# Altium project Tracker_v1_1.PrjPCB (part 2 of 2)
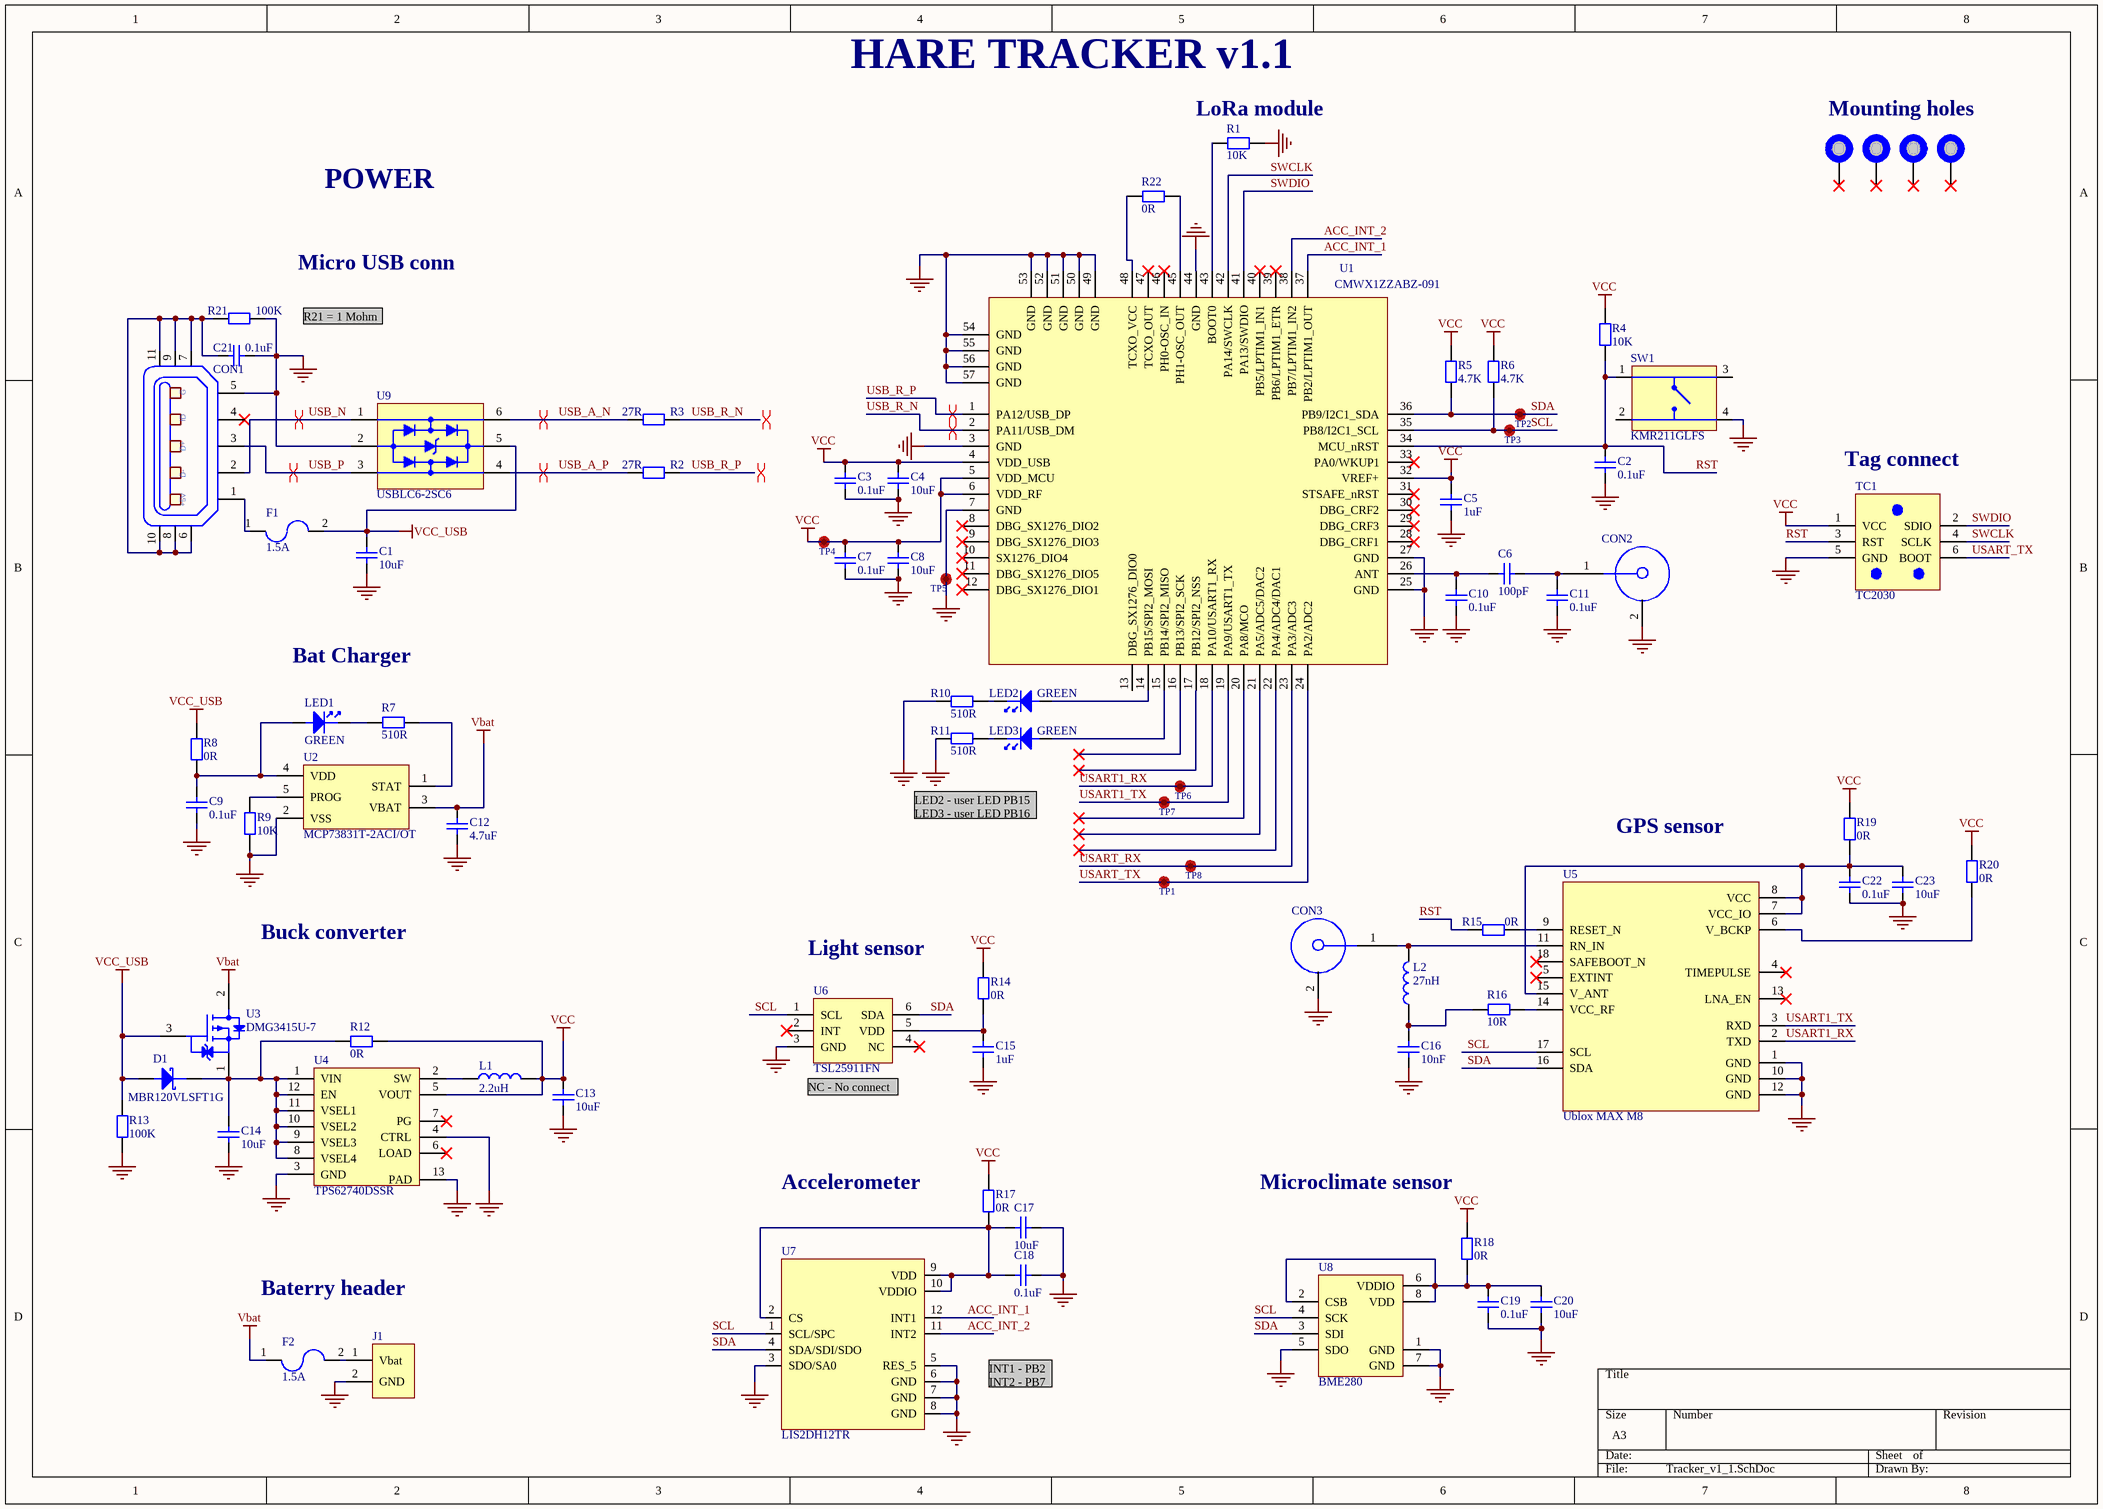
[diagram p1: Tracker_v1_1.SchDoc]

## Sheet Tracker_v1_1.SchDoc (continued)

### Library data of the parts
C1 C4 C8 C13 C14 C17 C20 C23 = C0603C106M8PACTU: CAP CER 10UF 10V X5R 0603; Manufacturer: KEMET; Supplier 1: Farnell; Manufacturer Part Number: C0603C106M8PACTU; Stock 1: 0; Pricing 1: 150=0.424, 500=0.311, 1000=0.26 (EUR); Supplier Part Number 1: 2820985RL
C2 C3 C7 C9-C11 C18 C19 C21 C22 = C0603C104J3RACTU: CAP CER 0.1UF 25V X7R 0603; Manufacturer: KEMET; Dielectric Material: Ceramic; Capacitance: 100nF; Tolerance: 5%; Supplier 1: Farnell; Manufacturer Part Number: C0603C104J3RACTU; Stock 1: 0; Pricing 1: 150=0.158, 500=0.132, 1000=0.12 (EUR); Mount: Surface Mount,PCB; Case/Package: 0603; Number of Pins: 2; Case Code (Metric): 1608; Case Code (Imperial): 0603; Contact Plating: Tin,Matte; Min Operating Temperature: -55°C; Max Operating Temperature: 125°C; Packaging: Tape and Reel; Dielectric: X7R; Package Quantity: 4000; Voltage Rating: 25V; Voltage Rating (DC): 25V; Termination: SMD/SMT; Voltage: 25V; Length: 1.6mm; Height: 0.8mm; Depth: 0.8mm; Width: 0.031inch; Thickness: 0.034inch; Lead Pitch: 0.7mm; Radiation Hardening: No; REACH SVHC: No SVHC; ComponentLink1URL: https://www.verical.com/server-webapp/html/getDatasheet?partID=33575&src-supplier=Verical; ComponentLink1Description: https://www.verical.com/server-webapp/html/getDatasheet?partID=33575&src-supplier=Verical; ComponentLink2URL: http://www.farnell.com/datasheets/1851736.pdf?src-supplier=Element14; ComponentLink2Description: http://www.farnell.com/datasheets/1851736.pdf?src-supplier=Element14; ComponentLink3URL: https://www.alliedelec.com/m/d/9bfe7773041ffe9d406e68bc7b377fdd.pdf?src-supplier=Allied+Electronics; ComponentLink3Description: https://www.alliedelec.com/m/d/9bfe7773041ffe9d406e68bc7b377fdd.pdf?src-supplier=Allied+Electronics; ComponentLink4URL: http://www.kemet.com/kemet/web/homepage/kechome.nsf/vapubfiles/KEM_C1002_X7R_SMD.pdf/$file/KEM_C1002_X7R_SMD.pdf?src-supplier=Element14; ComponentLink4Description: http://www.kemet.com/kemet/web/homepage/kechome.nsf/vapubfiles/KEM_C1002_X7R_SMD.pdf/$file/KEM_C1002_X7R_SMD.pdf?src-supplier=Element14; Supplier Part Number 1: 1650833RL
C5 C15 = C0603C105K8RACTU: Cap Ceramic 1uF 10V X7R 10% SMD 0603 125C T/R; Manufacturer: KEMET; Dissipation Factor: 5%; Supplier 1: Farnell; Manufacturer Part Number: C0603C105K8RACTU; Stock 1: 0; Pricing 1: 150=0.0567, 500=0.0425, 1000=0.0372 (EUR); Mount: Surface Mount; Case/Package: 0603; Case Code (Imperial): 0603; Case Code (Metric): 1608; Contact Plating: Tin,Matte; Dielectric Material: Ceramic; Min Operating Temperature: -55°C; Max Operating Temperature: 125°C; Packaging: Tape and Reel; Capacitance: 1uF; Package Quantity: 1; Voltage Rating: 10V; Voltage Rating (DC): 10V; Tolerance: 10%; Dielectric: X7R; Termination: SMD/SMT; Length: 1.6mm; Height: 0.8mm; Width: 0.8mm; Thickness: 0.035inch; Depth: 0.8mm; Radiation Hardening: No; REACH SVHC: No SVHC; ComponentLink1URL: https://www.verical.com/server-webapp/html/getDatasheet?partID=212378&src-supplier=Verical; ComponentLink1Description: https://www.verical.com/server-webapp/html/getDatasheet?partID=212378&src-supplier=Verical; Supplier Part Number 1: 2522396RL
C6 = C0603C101K5GACTU: Cap Ceramic 100pF 50V C0G 10% SMD 0603 125C Paper T/R; Manufacturer: KEMET; Dissipation Factor: 0.1%; Supplier 1: Farnell; Manufacturer Part Number: C0603C101K5GACTU; Stock 1: 0; Mount: Surface Mount,PCB; Case/Package: 0603; Dielectric Material: Ceramic; Case Code (Metric): 1608; Case Code (Imperial): 0603; Contact Plating: Tin,Matte; Min Operating Temperature: -55°C; Max Operating Temperature: 125°C; Capacitance: 100pF; Tolerance: 10%; Packaging: Tape and Reel; Voltage Rating (DC): 50V; Dielectric: C0G; Package Quantity: 1; Voltage Rating: 50V; Termination: SMD/SMT; Length: 1.6mm; Height: 0.8mm; Width: 0.031inch; Thickness: 0.034inch; Lead Pitch: 0.7mm; Depth: 0.8mm; Radiation Hardening: No; REACH SVHC: No SVHC; Lead Free: Lead Free; ComponentLink1URL: http://www.onlinecomponents.com/productFiles/mf-KEM/kem_c1003_c0g_smd.pdf?src-supplier=Onlinecomponents.com; ComponentLink1Description: http://www.onlinecomponents.com/productFiles/mf-KEM/kem_c1003_c0g_smd.pdf?src-supplier=Onlinecomponents.com; ComponentLink2URL: https://www.verical.com/server-webapp/html/getDatasheet?partID=77366&src-supplier=Verical; ComponentLink2Description: https://www.verical.com/server-webapp/html/getDatasheet?partID=77366&src-supplier=Verical; ComponentLink3URL: http://www.farnell.com/datasheets/1828801.pdf?src-supplier=Element14; ComponentLink3Description: http://www.farnell.com/datasheets/1828801.pdf?src-supplier=Element14; ComponentLink4URL: http://www.mouser.com/ds/2/212/KEM_C1003_C0G_SMD-1101588.pdf?src-supplier=Mouser; ComponentLink4Description: http://www.mouser.com/ds/2/212/KEM_C1003_C0G_SMD-1101588.pdf?src-supplier=Mouser; Supplier Part Number 1: 1823375
C12 = C0603C475K9PACTU: CAP CER 4.7UF 6.3V X5R 0603; Manufacturer: KEMET; Dielectric Material: Ceramic; Tolerance: 10%; Dissipation Factor: 5%; Supplier 1: Farnell; Manufacturer Part Number: C0603C475K9PACTU; Stock 1: 0; Mount: Surface Mount,PCB; Case/Package: 0603; Number of Pins: 2; Case Code (Metric): 1608; Case Code (Imperial): 0603; Contact Plating: Tin,Matte; Min Operating Temperature: -55°C; Max Operating Temperature: 85°C; Package Quantity: 1; Capacitance: 4.7uF; Voltage Rating: 6.3V; Packaging: Tape and Reel; Voltage Rating (DC): 6.3V; Dielectric: X5R; Termination: SMD/SMT; Voltage: 6.3V; Length: 1.6mm; Height: 0.8mm; Width: 0.031inch; Thickness: 0.035inch; Lead Pitch: 0.7mm; Depth: 0.8mm; Radiation Hardening: No; REACH SVHC: No SVHC; Lead Free: Lead Free; ComponentLink1URL: https://api.kemet.com/component-edge/download/datasheet/C0603C475K9PACTU.pdf?src-supplier=Digi-Key; ComponentLink1Description: https://api.kemet.com/component-edge/download/datasheet/C0603C475K9PACTU.pdf?src-supplier=Digi-Key; ComponentLink2URL: http://www.farnell.com/datasheets/1732700.pdf?src-supplier=Element14; ComponentLink2Description: http://www.farnell.com/datasheets/1732700.pdf?src-supplier=Element14; ComponentLink3URL: http://www.farnell.com/datasheets/1789732.pdf?src-supplier=Element14; ComponentLink3Description: http://www.farnell.com/datasheets/1789732.pdf?src-supplier=Element14; ComponentLink4URL: http://www.farnell.com/datasheets/40889.pdf?src-supplier=Element14; ComponentLink4Description: http://www.farnell.com/datasheets/40889.pdf?src-supplier=Element14; Supplier Part Number 1: 1310155
C16 = C0603C103J3GACTU: 0603 C 10nF Ceramic Multilayer Capacitor, 25 V, +125degC, C0G Dielectric, +/-5%; Manufacturer: KEMET; Tolerance: 5%; Voltage Rating (DC): 25V; Voltage: 50V; Temperature Coefficient: 30ppm/°C; Dissipation Factor: 0.1%; Supplier 1: Digi-Key; Manufacturer Part Number: C0603C103J3GACTU; Stock 1: 0; Mount: Surface Mount; Case/Package: 0603; Number of Pins: 2; Dielectric Material: Ceramic; Case Code (Metric): 1608; Case Code (Imperial): 0603; Contact Plating: Tin,Matte; Min Operating Temperature: -55°C; Max Operating Temperature: 125°C; Capacitance: 10nF; Packaging: Tape and Reel; Dielectric: C0G; Voltage Rating: 25V; Package Quantity: 4000; Termination: SMD/SMT; Length: 1.6mm; Height: 0.8mm; Depth: 0.8mm; Width: 0.8mm; Thickness: 0.034inch; Radiation Hardening: No; Lead Free: Lead Free; REACH SVHC: No SVHC; ComponentLink1URL: https://www.verical.com/server-webapp/html/getDatasheet?partID=556319&src-supplier=Verical; ComponentLink1Description: https://www.verical.com/server-webapp/html/getDatasheet?partID=556319&src-supplier=Verical; ComponentLink2URL: http://www.farnell.com/datasheets/2315092.pdf?src-supplier=Farnell; ComponentLink2Description: http://www.farnell.com/datasheets/2315092.pdf?src-supplier=Farnell; ComponentLink3URL: http://www.farnell.com/datasheets/1732695.pdf?src-supplier=Element14; ComponentLink3Description: http://www.farnell.com/datasheets/1732695.pdf?src-supplier=Element14; ComponentLink4URL: http://www.mouser.com/ds/2/212/KEM_C1003_C0G_SMD-1101588.pdf?src-supplier=Mouser; ComponentLink4Description: http://www.mouser.com/ds/2/212/KEM_C1003_C0G_SMD-1101588.pdf?src-supplier=Mouser; Supplier Part Number 1: C0603C103J3GACTU-ND
CON1 = Micro USB SMD: AMPHENOL FCI - 10104110-0001LF - MICRO USB, 2.0 TYPE B, RECEPTACLE, SMT; USB Connector Type: Micro USB Type B; USB Standard: USB 2.0; No. of Positions: 5; Connector Mounting: Surface Mount; SVHC: No SVHC (15-Jun-2015); Connector Type: USB Micro B; Contact Termination: Surface Mount Right Angle; No. of Contacts: 5Contacts<!--FANDB--><div class="features-and-benefits-container"><div class="features-and-benefits-description"><span class="features-benefits-value">The 10104110-0001LF is a micro-USB type-B Receptacle Connector, comply with physical, electrical and environmental requirements of micro-USB standard (USB 2.0). Space receptacles and plugs are available in a wide variety of mounting and termination configurations, permitting their use in various applications. Compared with the standard mini-B connectors, the size is reduced by approximately 60% while still allowing a high-speed data transfer of 480; Supplier 1: Farnell; Manufacturer: AMPHENOL FCI; Manufacturer Part Number: 10104110-0001LF; RoHS: YES; Stock 1: 25585; Pricing 1: 1=0.464, 10=0.451, 25=0.437, 50=0.424, 100=0.41, 250=0.291 (GBP); Gender: Receptacle; Orientation: Right Angle; Contact Material: Copper Alloy; Contact Plating: Gold Plated Contacts; Product Range: -; Contact Termination Type: Surface Mount; ComponentLink1URL: http://www.farnell.com/datasheets/1469072.pdf; ComponentLink1Description: http://www.farnell.com/datasheets/1469072.pdf; Supplier Part Number 1: 2293753
CON2 CON3 = 73412-0110: RF Connectors / Coaxial Connectors MCX V PCB JACK SMT 1.25MM MNT HGT; Manufacturer: Molex; Body Material: Liquid Crystal Polymer,Polymer; Body Plating: Gold; Impedance: 50R; Frequency: 6GHz; Voltage Rating: 60V; Gender: Female; Mating Cycles: 30; Insulation Resistance: 500MR; Polarity: Standard; Supplier 1: Farnell; Manufacturer Part Number: 73412-0110; Stock 1: 4654; Pricing 1: 1=0.402, 150=0.368, 400=0.334, 1250=0.327, 2500=0.32 (EUR); Mount: PCB,Surface Mount,Through Hole; Contact Material: Brass,Bronze; Contact Plating: Gold; Material: Bronze; Min Operating Temperature: -40°C; Max Operating Temperature: 90°C; Termination: Solder; Connector Type: Coaxial; Package Quantity: 5000; Packaging: Tape and Reel; Max Frequency: 6GHz; Orientation: Straight; Voltage Rating (AC): 60V; Radiation Hardening: No; REACH SVHC: Unknown; Halogen Free: Low Halogen; Lead Free: Lead Free; ComponentLink1URL: http://www.molex.com/webdocs/datasheets/pdf/en-us/0734120110_RF_COAX_CONNECTORS.pdf?src-supplier=Avnet+Europe; ComponentLink1Description: http://www.molex.com/webdocs/datasheets/pdf/en-us/0734120110_RF_COAX_CONNECTORS.pdf?src-supplier=Avnet+Europe; ComponentLink2URL: http://uk.rs-online.com/webdocs/13c4/0900766b813c49d5.pdf?src-supplier=RSComponents; ComponentLink2Description: http://uk.rs-online.com/webdocs/13c4/0900766b813c49d5.pdf?src-supplier=RSComponents; ComponentLink3URL: http://www.farnell.com/datasheets/1841262.pdf?src-supplier=Farnell; ComponentLink3Description: http://www.farnell.com/datasheets/1841262.pdf?src-supplier=Farnell; ComponentLink4URL: http://www.molex.com/webdocs/datasheets/pdf/en-us/0734120110_RF_COAX_CONNECTORS.pdf?src-supplier=Mouser; ComponentLink4Description: http://www.molex.com/webdocs/datasheets/pdf/en-us/0734120110_RF_COAX_CONNECTORS.pdf?src-supplier=Mouser; ComponentLink5URL: http://www.onlinecomponents.com/productFiles/mf-MOL/1387750734120110_rf_coax_nectors.pdf?src-supplier=Onlinecomponents.com; ComponentLink5Description: http://www.onlinecomponents.com/productFiles/mf-MOL/1387750734120110_rf_coax_nectors.pdf?src-supplier=Onlinecomponents.com; ComponentLink6URL: http://www.farnell.com/datasheets/1808577.pdf?src-supplier=Element14; ComponentLink6Description: http://www.farnell.com/datasheets/1808577.pdf?src-supplier=Element14; ComponentLink7URL: http://www.molex.com/webdocs/datasheets/pdf/en-us/0734120110_RF_COAX_CONNECTORS.pdf?src-supplier=Avnet; ComponentLink7Description: http://www.molex.com/webdocs/datasheets/pdf/en-us/0734120110_RF_COAX_CONNECTORS.pdf?src-supplier=Avnet; Supplier Part Number 1: 1340200
D1 = MBR120VLSFT1G: DIODE SCHOTTKY 20V 1A SOD123FL; Manufacturer: ON Semiconductor; Max Surge Current: 45A; Forward Voltage: 340mV; Peak Reverse Current: 600uA; Element Configuration: Single; Polarity: Standard; Supplier 1: Farnell; Manufacturer Part Number: MBR120VLSFT1G; Stock 1: 0; Number of Pins: 2; Contact Plating: Tin,Matte; Min Operating Temperature: -65°C; Max Operating Temperature: 125°C; Package Quantity: 3000; Forward Current: 1A; Packaging: Tape and Reel; Max Reverse Leakage Current: 600uA; Average Rectified Current: 1A; Max Repetitive Reverse Voltage (Vrrm): 20V; Max Forward Surge Current (Ifsm): 45A; Peak Non-Repetitive Surge Current: 45A; Voltage Rating (DC): 20V; Current Rating: 1A; Output Current: 1A; Max Reverse Voltage (DC): 20V; Length: 2.9mm; Height: 0.9mm; Width: 1.8mm; Radiation Hardening: No; REACH SVHC: No SVHC; Lead Free: Lead Free; Halogen Free: Halogen Free; ComponentLink1URL: http://www.farnell.com/datasheets/85900.pdf?src-supplier=Element14; ComponentLink1Description: http://www.farnell.com/datasheets/85900.pdf?src-supplier=Element14; ComponentLink2URL: http://www.onsemi.cn/pub_link/Collateral/MBR120VLSFT1-D.PDF?src-supplier=Avnet+Europe; ComponentLink2Description: http://www.onsemi.cn/pub_link/Collateral/MBR120VLSFT1-D.PDF?src-supplier=Avnet+Europe; ComponentLink3URL: https://www.alliedelec.com/m/d/71572cff3445748bb7aa75769c4030bb.pdf?src-supplier=Allied+Electronics; ComponentLink3Description: https://www.alliedelec.com/m/d/71572cff3445748bb7aa75769c4030bb.pdf?src-supplier=Allied+Electronics; ComponentLink4URL: http://www.onsemi.com/pub/Collateral/MBR120VLSFT1-D.PDF?src-supplier=Future+Electronics; ComponentLink4Description: http://www.onsemi.com/pub/Collateral/MBR120VLSFT1-D.PDF?src-supplier=Future+Electronics; ComponentLink5URL: http://www.onsemi.com/pub/Collateral/MBR120VLSFT1-D.PDF?src-supplier=Digi-Key; ComponentLink5Description: http://www.onsemi.com/pub/Collateral/MBR120VLSFT1-D.PDF?src-supplier=Digi-Key; ComponentLink6URL: http://www.onsemi.cn/pub_link/Collateral/MBR120VLSFT1-D.PDF?src-supplier=Avnet+Asia; ComponentLink6Description: http://www.onsemi.cn/pub_link/Collateral/MBR120VLSFT1-D.PDF?src-supplier=Avnet+Asia; Supplier Part Number 1: 2393584
F1 F2 = 046701.5NR: FUSE BOARD MNT 1.5A 32VAC 65VDC; Manufacturer: Littelfuse; Body Material: Thermoplastic; Voltage Rating (AC): 32V; DC Cold Resistance: 38.5mR; Power Dissipation: 121.7mW; Fuse Type: Board Mount (Cartridge Style Excluded); Resistance: 41mR; Approvals: UL,CSA; Supplier 1: Farnell; Manufacturer Part Number: 046701.5NR; Stock 1: 0; Mount: Surface Mount; Case/Package: 0603; Number of Pins: 2; Case Code (Metric): 1608; Case Code (Imperial): 0603; Min Operating Temperature: -55°C; Max Operating Temperature: 90°C; Voltage Rating (DC): 32V; Current Rating: 1.5A; Packaging: Tape and Reel; Package Quantity: 5000; Composition: Thin Film; Voltage Rating: 32V; Termination: SMD/SMT; Fuse Current: 1.5A; Working Voltage: 32V; Length: 1.6mm; Height: 0.012inch; Width: 0.813mm; Depth: 0.81mm; Radiation Hardening: No; REACH SVHC: Unknown; Lead Free: Lead Free; ComponentLink1URL: http://www.farnell.com/datasheets/1851810.pdf?src-supplier=Element14; ComponentLink1Description: http://www.farnell.com/datasheets/1851810.pdf?src-supplier=Element14; ComponentLink2URL: http://www.littelfuse.com/~/media/electronics/datasheets/fuses/littelfuse_fuse_467_datasheet.pdf.pdf?src-supplier=Digi-Key; ComponentLink2Description: http://www.littelfuse.com/~/media/electronics/datasheets/fuses/littelfuse_fuse_467_datasheet.pdf.pdf?src-supplier=Digi-Key; ComponentLink3URL: http://www.littelfuse.com/data/en/Data_Sheets/467.pdf?src-supplier=Future+Electronics; ComponentLink3Description: http://www.littelfuse.com/data/en/Data_Sheets/467.pdf?src-supplier=Future+Electronics; ComponentLink4URL: https://www.verical.com/server-webapp/html/getDatasheet?partID=772543&src-supplier=Verical; ComponentLink4Description: https://www.verical.com/server-webapp/html/getDatasheet?partID=772543&src-supplier=Verical; Supplier Part Number 1: 1596948RL
J1 = Header 2x1
L1 = L1210R2R2MDWIT: FIXED IND 2.2UH 2A 80 MOHM SMD; Manufacturer: KEMET; Core Material: Ferrite; Tolerance: 20%; Shielding: Unshielded; Self Resonant Frequency: 190MHz; DC Resistance (DCR): 80mR; Test Frequency: 100kHz; DC Current: 1.13A; Supplier 1: Digi-Key; Manufacturer Part Number: L1210R2R2MDWIT; Stock 1: 17546; Pricing 1: 1=0.55, 10=0.479, 100=0.3421, 500=0.2874 (USD); Mount: Surface Mount; Case/Package: 1210; Case Code (Metric): 3225; Case Code (Imperial): 1210; Min Operating Temperature: -40°C; Max Operating Temperature: 105°C; Package Quantity: 1000; Current Rating: 2A; Packaging: Tape and Reel; Inductance Tolerance: 20%; Composition: Ceramic,Wirewound; Inductance: 2.2uH; Max DC Current: 2A; Termination: SMD/SMT; Military Standard: Not; Length: 0.126inch; Height: 2.5mm; Width: 0.098inch; Height - Seated (Max): 0.106inch; Depth: 2.7mm; Radiation Hardening: No; REACH SVHC: No SVHC; ComponentLink1URL: https://content.kemet.com/datasheets/F3115.pdf?src-supplier=Mouser; ComponentLink1Description: https://content.kemet.com/datasheets/F3115.pdf?src-supplier=Mouser; ComponentLink2URL: https://content.kemet.com/datasheets/F3115.pdf?src-supplier=Avnet+Europe; ComponentLink2Description: https://content.kemet.com/datasheets/F3115.pdf?src-supplier=Avnet+Europe; ComponentLink3URL: http://www.farnell.com/datasheets/27262.pdf?src-supplier=Element14; ComponentLink3Description: http://www.farnell.com/datasheets/27262.pdf?src-supplier=Element14; ComponentLink4URL: https://api.kemet.com/component-edge/download/datasheet/L1210R2R2MDWIT.pdf?src-supplier=Digi-Key; ComponentLink4Description: https://api.kemet.com/component-edge/download/datasheet/L1210R2R2MDWIT.pdf?src-supplier=Digi-Key; ComponentLink5URL: http://www.kemet.com/Lists/ProductCatalog/Attachments/57/F3115.pdf?src-supplier=Avnet; ComponentLink5Description: http://www.kemet.com/Lists/ProductCatalog/Attachments/57/F3115.pdf?src-supplier=Avnet; Supplier Part Number 1: 399-9598-6-ND
L2 = LQG18HN27NJ00D: Inductor RF Chip Multi-Layer 27nH 5% 100MHz 12Q-Factor Air 300mA 550mOhm DCR 0603 T/R; Manufacturer: Murata; DC Resistance (DCR): 550mR; Q Factor: 12; Self Resonant Frequency: 2GHz; Shielding: Unshielded; Supplier 1: Digi-Key; Manufacturer Part Number: LQG18HN27NJ00D; Stock 1: 0; Mount: Surface Mount; Case/Package: 0603; Core Material: Air; Case Code (Metric): 1608; Case Code (Imperial): 0603; Min Operating Temperature: -55°C; Max Operating Temperature: 85°C; Tolerance: 5%; Inductance: 27nH; Packaging: Tape and Reel; Current Rating: 300mA; Max DC Current: 300mA; Inductance Tolerance: 5%; Package Quantity: 4000; Termination: SMD/SMT; Test Frequency: 100MHz; DC Current: 300mA; Military Standard: Not; Length: 0.063inch; Height: 0.8mm; Width: 0.8mm; Height - Seated (Max): 0.037inch; Depth: 0.95mm; Radiation Hardening: No; REACH SVHC: No SVHC; Lead Free: Lead Free; ComponentLink1URL: http://search.murata.co.jp/Ceramy/image/img/P02/JELF243B-0002.pdf?src-supplier=Digi-Key; ComponentLink1Description: http://search.murata.co.jp/Ceramy/image/img/P02/JELF243B-0002.pdf?src-supplier=Digi-Key; ComponentLink2URL: http://www.farnell.com/datasheets/5102.pdf?src-supplier=Element14; ComponentLink2Description: http://www.farnell.com/datasheets/5102.pdf?src-supplier=Element14; ComponentLink3URL: http://psearch.en.murata.com/inductor/product/LQG18HN27NJ00_.pdf?src-supplier=Digi-Key; ComponentLink3Description: http://psearch.en.murata.com/inductor/product/LQG18HN27NJ00_.pdf?src-supplier=Digi-Key; ComponentLink4URL: http://search.murata.co.jp/Ceramy/image/img/PDF/ENG/L0075S0083LQG18H.pdf?src-supplier=Avnet; ComponentLink4Description: http://search.murata.co.jp/Ceramy/image/img/PDF/ENG/L0075S0083LQG18H.pdf?src-supplier=Avnet; ComponentLink5URL: http://search.murata.co.jp/Ceramy/image/img/PDF/ENG/L0075S0083LQG18H.pdf?src-supplier=Avnet+Europe; ComponentLink5Description: http://search.murata.co.jp/Ceramy/image/img/PDF/ENG/L0075S0083LQG18H.pdf?src-supplier=Avnet+Europe; ComponentLink6URL: http://uk.rs-online.com/webdocs/0f10/0900766b80f1087c.pdf?src-supplier=RSComponents; ComponentLink6Description: http://uk.rs-online.com/webdocs/0f10/0900766b80f1087c.pdf?src-supplier=RSComponents; Supplier Part Number 1: 490-6579-2-ND
LED1-LED3 = KP-1608CGCK: KINGBRIGHT - KP-1608CGCK - LED, 0603, 50MCD, GREEN; Lens Color: Clear; Viewing Angle: 120°; Lens Style: Rectangular,Diffused,Colorless; Dominant Wavelength: 570nm; Number of LEDs: 1; Forward Voltage: 2.1V; Forward Current: 20mA; Supplier 1: Farnell; Manufacturer: Kingbright; Manufacturer Part Number: KP-1608CGCK; Stock 1: 18535; Pricing 1: 5=0.157, 50=0.143, 100=0.0934, 500=0.0789, 1000=0.0621 (EUR); Mount: Surface Mount; Case/Package: 1608; Number of Pins: 2; Color: Green; Luminous Intensity: 50mcd; Wavelength: 570nm; Packaging: Tape and Reel; Length: 0.8mm; Height: 1.1mm; Width: 1.6mm; Radiation Hardening: No; REACH SVHC: No SVHC; ComponentLink1URL: http://www.farnell.com/datasheets/2045956.pdf?src-supplier=Element14; ComponentLink1Description: http://www.farnell.com/datasheets/2045956.pdf?src-supplier=Element14; ComponentLink2URL: http://www.rapidonline.com/pdf/72-8670.pdf?src-supplier=Rapid+Electronics; ComponentLink2Description: http://www.rapidonline.com/pdf/72-8670.pdf?src-supplier=Rapid+Electronics; Supplier Part Number 1: 2290328
MH1-MH4 = MH_7.4MM_NC
R1 R4 R9 = CR0603-JW-103EAS: RES 10K OHM 5% 0.01W 0603; Manufacturer: Bourns; Supplier 1: Farnell; Manufacturer Part Number: CR0603-JW-103EAS; Stock 1: 0; Pricing 1: 150=0.0181, 500=0.0155, 1000=0.007 (EUR); Supplier Part Number 1: 2752989RL
R2 R3 = CRCW060327R0FKEA: RES SMD 27 OHM 1% 1/10W 0603; Manufacturer: Vishay; Power Rating: 100mW; Temperature Coefficient: 100ppm/°C; Voltage Rating: 75V; Supplier 1: Farnell; Manufacturer Part Number: CRCW060327R0FKEA; Stock 1: 0; Mount: Surface Mount; Case/Package: 0603; Number of Pins: 2; Weight: 7.1E-05oz; Contact Plating: Tin; Case Code (Imperial): 0603; Case Code (Metric): 1608; Min Operating Temperature: -55°C; Max Operating Temperature: 155°C; Resistance: 27R; Tolerance: 1%; Composition: Thick Film; Packaging: Tape and Reel; Termination: SMD/SMT; Package Quantity: 5000; Military Standard: Not; Voltage Rating (DC): 75V; Length: 1.55mm; Height: 0.45mm; Width: 0.85mm; Depth: 0.85mm; Radiation Hardening: No; REACH SVHC: Unknown; Lead Free: Lead Free; ComponentLink1URL: http://www.mouser.com/ds/2/427/dcrcwe3-109170.pdf?src-supplier=Mouser; ComponentLink1Description: http://www.mouser.com/ds/2/427/dcrcwe3-109170.pdf?src-supplier=Mouser; ComponentLink2URL: http://www.farnell.com/datasheets/2046716.pdf?src-supplier=Element14; ComponentLink2Description: http://www.farnell.com/datasheets/2046716.pdf?src-supplier=Element14; ComponentLink3URL: http://www.farnell.com/datasheets/1697337.pdf?src-supplier=Element14; ComponentLink3Description: http://www.farnell.com/datasheets/1697337.pdf?src-supplier=Element14; ComponentLink4URL: http://www.farnell.com/datasheets/2111203.pdf?src-supplier=Element14; ComponentLink4Description: http://www.farnell.com/datasheets/2111203.pdf?src-supplier=Element14; ComponentLink5URL: http://uk.rs-online.com/webdocs/0d98/0900766b80d98afc.pdf?src-supplier=RSComponents; ComponentLink5Description: http://uk.rs-online.com/webdocs/0d98/0900766b80d98afc.pdf?src-supplier=RSComponents; ComponentLink6URL: http://www.vishay.com/docs/20035/dcrcwe3.pdf?src-supplier=Avnet+Europe; ComponentLink6Description: http://www.vishay.com/docs/20035/dcrcwe3.pdf?src-supplier=Avnet+Europe; ComponentLink7URL: http://www.alliedelec.com/m/d/0c934d6939ccefa68dbe0b96d821c8cf.pdf?src-supplier=Allied+Electronics; ComponentLink7Description: http://www.alliedelec.com/m/d/0c934d6939ccefa68dbe0b96d821c8cf.pdf?src-supplier=Allied+Electronics; ComponentLink8URL: http://www.vishay.com/docs/20035/dcrcwe3.pdf?src-supplier=Future+Electronics; ComponentLink8Description: http://www.vishay.com/docs/20035/dcrcwe3.pdf?src-supplier=Future+Electronics; Supplier Part Number 1: 1151876
R5 R6 = CR0603-JW-472ELF: Res Thick Film 0603 4.7K Ohm 5% 1/10W ±200ppm/°C Molded SMD SMD Paper Tape on Plastic Reel; Manufacturer: Bourns; Resistance: 4.7kR; Power Rating: 100mW; Voltage Rating: 50V; Supplier 1: Farnell; Manufacturer Part Number: CR0603-JW-472ELF; Stock 1: 0; Mount: Surface Mount; Case/Package: 0603; Number of Pins: 2; Case Code (Metric): 1608; Case Code (Imperial): 0603; Contact Plating: Tin,Lead; Min Operating Temperature: -55°C; Max Operating Temperature: 155°C; Package Quantity: 1; Tolerance: 5%; Packaging: Tape and Reel; Composition: Thick Film; Number of Terminations: 2; Termination: SMD/SMT; Temperature Coefficient: 200ppm/°C; Max Power Dissipation: 100mW; Voltage Rating (DC): 50V; Features: Moisture Resistant; Length: 1.6mm; Height: 0.45mm; Width: 0.8mm; Depth: 0.8mm; Thickness: 457um; Radiation Hardening: No; REACH SVHC: No SVHC; ComponentLink1URL: http://www.farnell.com/datasheets/2178762.pdf?src-supplier=Newark; ComponentLink1Description: http://www.farnell.com/datasheets/2178762.pdf?src-supplier=Newark; ComponentLink2URL: http://www.bourns.com/pdfs/chpreztr.pdf?src-supplier=Avnet; ComponentLink2Description: http://www.bourns.com/pdfs/chpreztr.pdf?src-supplier=Avnet; ComponentLink3URL: https://www.alliedelec.com/m/d/8318635a9e5af6f7dacb272be3e73d2e.pdf?src-supplier=Allied+Electronics; ComponentLink3Description: https://www.alliedelec.com/m/d/8318635a9e5af6f7dacb272be3e73d2e.pdf?src-supplier=Allied+Electronics; ComponentLink4URL: http://www.farnell.com/datasheets/1856384.pdf?src-supplier=Element14; ComponentLink4Description: http://www.farnell.com/datasheets/1856384.pdf?src-supplier=Element14; ComponentLink5URL: http://uk.rs-online.com/webdocs/0fcd/0900766b80fcdb72.pdf?src-supplier=RSComponents; ComponentLink5Description: http://uk.rs-online.com/webdocs/0fcd/0900766b80fcdb72.pdf?src-supplier=RSComponents; ComponentLink6URL: http://www.produktinfo.conrad.com/datenblaetter/1000000-1099999/001055503-da-01-en-SMD_WID_CR0603_JW_472ELF_4_7K_OHM_1_10W.pdf?src-supplier=Conrad; ComponentLink6Description: http://www.produktinfo.conrad.com/datenblaetter/1000000-1099999/001055503-da-01-en-SMD_WID_CR0603_JW_472ELF_4_7K_OHM_1_10W.pdf?src-supplier=Conrad; Supplier Part Number 1: 2371774
R7 R10 R11 = CR0603-JW-511ELF: Res Thick Film 0603 510 Ohm 5% 1/10W ±200ppm/°C Molded SMD SMD Paper Tape on Plastic Reel; Manufacturer: Bourns; Power Rating: 100mW; Voltage Rating: 50V; Supplier 1: Farnell; Manufacturer Part Number: CR0603-JW-511ELF; Stock 1: 79590; Pricing 1: 10=0.016, 100=0.0113, 500=0.0089, 1000=0.0077 (EUR); Mount: Surface Mount; Case/Package: 0603; Case Code (Imperial): 0603; Case Code (Metric): 1608; Contact Plating: Tin; Min Operating Temperature: -55°C; Max Operating Temperature: 155°C; Resistance: 510R; Tolerance: 5%; Packaging: Tape and Reel; Package Quantity: 1; Composition: Thick Film; Termination: SMD/SMT; Number of Terminations: 2; Temperature Coefficient: 200ppm/°C; Military Standard: Not; Max Power Dissipation: 100mW; Features: Moisture Resistant; Length: 1.6mm; Height: 0.022inch; Width: 0.8mm; Depth: 0.8mm; Thickness: 457um; Radiation Hardening: No; ComponentLink1URL: http://www.bourns.com/pdfs/chpreztr.pdf?src-supplier=Avnet; ComponentLink1Description: http://www.bourns.com/pdfs/chpreztr.pdf?src-supplier=Avnet; ComponentLink2URL: http://www.mouser.com/ds/2/54/chpreztr-977002.pdf?src-supplier=Mouser; ComponentLink2Description: http://www.mouser.com/ds/2/54/chpreztr-977002.pdf?src-supplier=Mouser; ComponentLink3URL: https://www.bourns.com/docs/Product-Datasheets/CHPREZTR.pdf?src-supplier=Digi-Key; ComponentLink3Description: https://www.bourns.com/docs/Product-Datasheets/CHPREZTR.pdf?src-supplier=Digi-Key; Supplier Part Number 1: 2908378
R8 R12 R14 R15 R17-R20 R22 = RMCF0603ZT0R00: RES 0 OHM JUMPER 1/10W 0603; Manufacturer: Stackpole Electronics; Resistance: 0mR; Power Rating: 100mW; Current Rating: 1A; Working Voltage: 75V; Supplier 1: Digi-Key; Manufacturer Part Number: RMCF0603ZT0R00; Stock 1: 0; Mount: Surface Mount; Case/Package: 0603; Case Code (Metric): 1608; Case Code (Imperial): 0603; Contact Plating: Tin,Matte; Min Operating Temperature: -55°C; Max Operating Temperature: 155°C; Packaging: Tape and Reel; Composition: Thick Film; Number of Terminations: 2; Military Standard: Not; Max Power Dissipation: 100mW; Features: Automotive AEC-Q200; Length: 1.55mm; Height: 0.022inch; Width: 0.031inch; Depth: 0.8mm; Radiation Hardening: No; Lead Free: Lead Free; Supplier Part Number 1: RMCF0603ZT0R00-ND
R13 R21 = CPF-A-0603B100KE1: TE CONNECTIVITY         CPF-A-0603B100KE1             SMD Chip Resistor, Thin Film, 100 kohm, 50 V, 0603 [1608 Metric], 62.5 mW,  0.1%, CPF-A Series; Resistance: 100kR; Power Rating: 63mW; Voltage Rating: 50V; Temperature Coefficient: 25ppm/°C; Number of Resistors: 1; Supplier 1: Farnell; Manufacturer: TE Connectivity; Manufacturer Part Number: CPF-A-0603B100KE1; Stock 1: 0; Pricing 1: 150=0.209, 250=0.198, 500=0.172, 1000=0.135, 5000=0.13 (EUR); Mount: Surface Mount; Case/Package: 0603; Case Code (Metric): 1608; Case Code (Imperial): 0603; Packaging: Tape and Reel; Composition: Thin Film; Tolerance: 0.1%; Voltage Rating (DC): 50V; Number of Terminations: 2; Termination: Solder; REACH SVHC: No SVHC; ELV: Compliant; Supplier Part Number 1: 2483881RL
R16 = CRCW060310R0FKEA: RES SMD 10 OHM 1% 1/10W 0603; Manufacturer: Vishay; Power Rating: 100mW; Temperature Coefficient: 100ppm/°C; Voltage Rating: 75V; Supplier 1: Digi-Key; Manufacturer Part Number: CRCW060310R0FKEA; Stock 1: 0; Mount: Surface Mount; Case/Package: 0603; Number of Pins: 2; Weight: 7.1E-05oz; Contact Plating: Tin; Case Code (Metric): 1608; Case Code (Imperial): 0603; Min Operating Temperature: -55°C; Max Operating Temperature: 155°C; Resistance: 10R; Tolerance: 1%; Composition: Thick Film; Packaging: Tape and Reel; Package Quantity: 10; Number of Terminations: 2; Termination: SMD/SMT; Military Standard: Not; Max Power Dissipation: 100mW; Voltage Rating (DC): 75V; Features: Automotive AEC-Q200; Length: 1.55mm; Height: 0.45mm; Width: 0.033inch; Depth: 0.85mm; Lead Free: Lead Free; REACH SVHC: Unknown; ComponentLink1URL: http://www.vishay.com/docs/20035/dcrcwe3.pdf?src-supplier=Digi-Key; ComponentLink1Description: http://www.vishay.com/docs/20035/dcrcwe3.pdf?src-supplier=Digi-Key; ComponentLink2URL: http://uk.rs-online.com/webdocs/0d98/0900766b80d98afc.pdf?src-supplier=RSComponents; ComponentLink2Description: http://uk.rs-online.com/webdocs/0d98/0900766b80d98afc.pdf?src-supplier=RSComponents; ComponentLink3URL: http://www.vishay.com/docs/20035/dcrcwe3.pdf?src-supplier=Future+Electronics; ComponentLink3Description: http://www.vishay.com/docs/20035/dcrcwe3.pdf?src-supplier=Future+Electronics; ComponentLink4URL: https://www.distrelec.biz/Web/Downloads/a_/en/flD-CRCW-e3_data_en.pdf?mime=application%2Fpdf&src-supplier=Distrelec; ComponentLink4Description: https://www.distrelec.biz/Web/Downloads/a_/en/flD-CRCW-e3_data_en.pdf?mime=application%2Fpdf&src-supplier=Distrelec; ComponentLink5URL: http://www.alliedelec.com/m/d/0c934d6939ccefa68dbe0b96d821c8cf.pdf?src-supplier=Allied+Electronics; ComponentLink5Description: http://www.alliedelec.com/m/d/0c934d6939ccefa68dbe0b96d821c8cf.pdf?src-supplier=Allied+Electronics; ComponentLink6URL: http://www.vishay.com/docs/20035/dcrcwe3.pdf?src-supplier=Avnet; ComponentLink6Description: http://www.vishay.com/docs/20035/dcrcwe3.pdf?src-supplier=Avnet; ComponentLink7URL: http://www.mouser.com/ds/2/427/dcrcwe3-109170.pdf?src-supplier=Mouser; ComponentLink7Description: http://www.mouser.com/ds/2/427/dcrcwe3-109170.pdf?src-supplier=Mouser; ComponentLink8URL: http://www.farnell.com/datasheets/2045673.pdf?src-supplier=Element14; ComponentLink8Description: http://www.farnell.com/datasheets/2045673.pdf?src-supplier=Element14; Supplier Part Number 1: 541-10.0HTR-ND
SW1 = KMR211GLFS: SWITCH TACTILE SPST-NO 0.05A 32V; Manufacturer: ITT C&K; Mechanical Life: 200000Cycles; Operating Force: 1.2N; Throw Configuration: SPST; Max Current Rating: 50mA; Power Rating: 1W; Illumination Type: Non-Illuminated,Illuminated; Switch Travel: 0.2mm; Switch Function: Off-Mom; Actuator Type: Standard; Actuator Length: 0.5mm; Supplier 1: Farnell; Manufacturer Part Number: KMR211GLFS; Stock 1: 0; Mount: Surface Mount; Contact Material: Silver; Contact Plating: Silver; Min Operating Temperature: -40°C; Max Operating Temperature: 85°C; Max Voltage Rating (DC): 32V; Termination: Gull Wing; Packaging: Tape and Reel; Orientation: Straight; Contact Current Rating: 50mA; Voltage Rating (DC): 32V; Package Quantity: 1; Current Rating: 50mA; Length: 2.8mm; Depth: 4.6mm; Width: 2.8mm; Radiation Hardening: No; REACH SVHC: No SVHC; Lead Free: Lead Free; ComponentLink1URL: http://uk.rs-online.com/webdocs/129c/0900766b8129c9f0.pdf?src-supplier=RSComponents; ComponentLink1Description: http://uk.rs-online.com/webdocs/129c/0900766b8129c9f0.pdf?src-supplier=RSComponents; ComponentLink2URL: http://www1.futureelectronics.com/doc/C%20-%20K%20COMPONENTS/KMR211GLFS.pdf?src-supplier=Future+Electronics; ComponentLink2Description: http://www1.futureelectronics.com/doc/C%20-%20K%20COMPONENTS/KMR211GLFS.pdf?src-supplier=Future+Electronics; ComponentLink3URL: http://www.farnell.com/datasheets/2044619.pdf?src-supplier=Element14; ComponentLink3Description: http://www.farnell.com/datasheets/2044619.pdf?src-supplier=Element14; ComponentLink4URL: http://www.ck-components.com/14414/kmr2_9aug12.pdf/?src-supplier=Avnet; ComponentLink4Description: http://www.ck-components.com/14414/kmr2_9aug12.pdf/?src-supplier=Avnet; ComponentLink5URL: http://www.ck-components.com/14414/kmr2_9aug12.pdf/?src-supplier=Avnet+Europe; ComponentLink5Description: http://www.ck-components.com/14414/kmr2_9aug12.pdf/?src-supplier=Avnet+Europe; ComponentLink6URL: https://www.ckswitches.com/media/1479/kmr2.pdf?src-supplier=Digi-Key; ComponentLink6Description: https://www.ckswitches.com/media/1479/kmr2.pdf?src-supplier=Digi-Key; ComponentLink7URL: http://www.ckswitches.com/media/1479/kmr2.pdf?src-supplier=Onlinecomponents.com; ComponentLink7Description: http://www.ckswitches.com/media/1479/kmr2.pdf?src-supplier=Onlinecomponents.com; Supplier Part Number 1: 1437635RL
TP1-TP8 = TestPoint: TEST POINT ROUND SMD; FIT: 0.94; Komp / Device: SMD; ComponentLink1Description: Datasheet
U1 = CMWX1ZZABZ-091: MURATA - CMWX1ZZABZ-091 - RF MODULE, 860-930MHZ, 4.8KBPS, 18.5DBM; Supplier 1: Farnell; Manufacturer: Murata; Manufacturer Part Number: CMWX1ZZABZ-091; Stock 1: 1534; Pricing 1: 1=16.46, 5=16.26, 10=13.54, 50=12.97, 100=12.39, 250=9.81 (EUR); Supplier Part Number 1: 2802546
U2 = MCP73831T-2ACI/OT: MICROCHIP - MCP73831T-2ACI/OT - LI-ION/LI-POLY CHARGE CONTROLLER; Number of Cells: 1; Output Voltage: 4.2V; Max Supply Voltage: 6V; Min Supply Voltage: 3.75V; Output Current: 500mA; Max Output Voltage: 4.5V; Min Output Voltage: 4.168V; Max Power Dissipation: 1.54W; Drain to Source Resistance: 350mR; Voltage Rating: 4.534V; Supplier 1: Farnell; Manufacturer: Microchip; Manufacturer Part Number: MCP73831T-2ACI/OT; Stock 1: 14250; Pricing 1: 1=0.493, 10=0.484, 25=0.412, 50=0.39, 100=0.368 (EUR); Mount: Surface Mount; Case/Package: SOT-23; Number of Pins: 5; Weight: 0.00709oz; Contact Plating: Tin,Matte; Min Operating Temperature: -40°C; Max Operating Temperature: 85°C; Packaging: Tape and Reel; Max Charge Current: 500mA; Max Input Voltage: 6V; Number of Outputs: 1; Number of Channels: 1; Termination: SMD/SMT; Length: 0.122inch; Height: 0.051inch; Width: 0.071inch; Radiation Hardening: No; REACH SVHC: No SVHC; Lead Free: Lead Free; ComponentLink1URL: http://www.microchip.com/mymicrochip/filehandler.aspx?ddocname=en023833&src-supplier=Digi-Key; ComponentLink1Description: http://www.microchip.com/mymicrochip/filehandler.aspx?ddocname=en023833&src-supplier=Digi-Key; ComponentLink2URL: http://www.farnell.com/datasheets/630369.pdf?src-supplier=Element14; ComponentLink2Description: http://www.farnell.com/datasheets/630369.pdf?src-supplier=Element14; ComponentLink3URL: http://www.farnell.com/datasheets/2124927.pdf?src-supplier=Element14; ComponentLink3Description: http://www.farnell.com/datasheets/2124927.pdf?src-supplier=Element14; ComponentLink4URL: http://ww1.microchip.com/downloads/en/DeviceDoc/21984e.pdf?src-supplier=Avnet; ComponentLink4Description: http://ww1.microchip.com/downloads/en/DeviceDoc/21984e.pdf?src-supplier=Avnet; ComponentLink5URL: http://www.farnell.com/datasheets/2124927.pdf?src-supplier=Newark; ComponentLink5Description: http://www.farnell.com/datasheets/2124927.pdf?src-supplier=Newark; ComponentLink6URL: http://www.microchip.com/mymicrochip/filehandler.aspx?ddocname=en025112&src-supplier=Future+Electronics; ComponentLink6Description: http://www.microchip.com/mymicrochip/filehandler.aspx?ddocname=en025112&src-supplier=Future+Electronics; ComponentLink7URL: http://www.produktinfo.conrad.com/datenblaetter/650000-674999/651521-da-01-en-CONTR__MCP73831T_2ACI_OT_SOT_23_5_MCP.pdf?src-supplier=Conrad; ComponentLink7Description: http://www.produktinfo.conrad.com/datenblaetter/650000-674999/651521-da-01-en-CONTR__MCP73831T_2ACI_OT_SOT_23_5_MCP.pdf?src-supplier=Conrad; Supplier Part Number 1: 1332158
U3 = DMG3415U-7: MOSFET P-CH 20V 4A SOT-23; Manufacturer: Diodes; Rise Time: 117ns; Rds On Max: 39mR; Input Capacitance: 294pF; Nominal Vgs: -550mV; Number of Elements: 1; Max Power Dissipation: 900mW; Drain to Source Resistance: 42.5mR; Gate to Source Voltage (Vgs): 8V; Fall Time: 393ns; Turn-Off Delay Time: 795ns; Turn-On Delay Time: 71ns; Element Configuration: Single; Drain to Source Breakdown Voltage: -20V; Supplier 1: Farnell; Manufacturer Part Number: DMG3415U-7; Stock 1: 0; Mount: Surface Mount; Case/Package: SOT-23; Number of Pins: 3; Weight: 0.000282oz; Contact Plating: Tin,Matte; Min Operating Temperature: -55°C; Max Operating Temperature: 150°C; Packaging: Tape and Reel; Package Quantity: 3000; Drain to Source Voltage (Vdss): 20V; Continuous Drain Current (ID): 4A; Number of Channels: 1; Power Dissipation: 900mW; Threshold Voltage: -550mV; On-State Resistance: 42.5mR; Length: 2.9mm; Height: 1mm; Width: 1.3mm; Radiation Hardening: No; REACH SVHC: No SVHC; Lead Free: Lead Free; ComponentLink1URL: http://www.diodes.com/datasheets/ds31735.pdf?src-supplier=Avnet; ComponentLink1Description: http://www.diodes.com/datasheets/ds31735.pdf?src-supplier=Avnet; ComponentLink2URL: https://www.diodes.com/assets/Datasheets/ds31735.pdf?src-supplier=Digi-Key; ComponentLink2Description: https://www.diodes.com/assets/Datasheets/ds31735.pdf?src-supplier=Digi-Key; ComponentLink3URL: http://www.mouser.com/ds/2/115/ds31735-64958.pdf?src-supplier=Mouser; ComponentLink3Description: http://www.mouser.com/ds/2/115/ds31735-64958.pdf?src-supplier=Mouser; ComponentLink4URL: http://www.farnell.com/datasheets/1915618.pdf?src-supplier=Element14; ComponentLink4Description: http://www.farnell.com/datasheets/1915618.pdf?src-supplier=Element14; ComponentLink5URL: http://www.diodes.com/_files/datasheets/ds31735.pdf?src-supplier=Future+Electronics; ComponentLink5Description: http://www.diodes.com/_files/datasheets/ds31735.pdf?src-supplier=Future+Electronics; Supplier Part Number 1: 1843688RL
U4 = TPS62740DSSR: Switching Voltage Regulators 360-nA Iq SD Cnvtr w/ Intg Load Switch; Manufacturer: Texas Instruments; Number of Outputs: 1; Output Voltage: 3.3V; Max Output Current: 300mA; Min Input Voltage: 2.2V; Max Input Voltage: 5.5V; Efficiency: 90%; Switching Frequency: 2MHz; Min Output Voltage: 1.8V; Quiescent Current: 300nA; Supplier 1: Farnell; Manufacturer Part Number: TPS62740DSSR; Stock 1: 0; Pricing 1: 3000=0.685, 6000=0.679, 9000=0.672 (EUR); Mount: Surface Mount; Number of Pins: 12; Min Operating Temperature: -40°C; Max Operating Temperature: 85°C; Package Quantity: 3000; Packaging: Tape and Reel; Output Current: 300mA; Min Supply Voltage: 2.2V; Operating Supply Current: 300mA; Max Output Voltage: 3.3V; Operating Supply Voltage: 5.5V; Radiation Hardening: No; REACH SVHC: No SVHC; Lead Free: Lead Free; ComponentLink1URL: http://www.ti.com/lit/ds/symlink/tps62740.pdf?src-supplier=Digi-Key; ComponentLink1Description: http://www.ti.com/lit/ds/symlink/tps62740.pdf?src-supplier=Digi-Key; ComponentLink2URL: http://www.ti.com/lit/ds/symlink/tps62740.pdf?src-supplier=Avnet; ComponentLink2Description: http://www.ti.com/lit/ds/symlink/tps62740.pdf?src-supplier=Avnet; Supplier Part Number 1: 2542791
U5 = MAX-M8Q-0: Rf Rcvr Gnss/gps 1.575GHZ 18LCC; Manufacturer: u-blox; Supplier 1: Digi-Key; Manufacturer Part Number: MAX-M8Q-0; Stock 1: 10805; Supplier Part Number 1: 672-1003-6-ND
U6 = TSL25911FN: IC LIGHT TO DGTL CONV 6-DFN; Manufacturer: ams TAOS; Wavelength: 850nm; Interface: I2C; Data Bus Width: 16b; Max Frequency: 400kHz; Operating Supply Voltage: 3V; Supplier 1: Digi-Key; Manufacturer Part Number: TSL25911FN; Stock 1: 28000; Case/Package: WFDFN; Number of Pins: 6; Min Operating Temperature: -30°C; Max Operating Temperature: 70°C; Packaging: Tape and Reel; Package Quantity: 1; Output Type: I2C; Lead Free: Lead Free; ComponentLink1URL: http://www.mouser.com/ds/2/588/TSL2591_DS000338_3-00-253098.pdf?src-supplier=Mouser; ComponentLink1Description: http://www.mouser.com/ds/2/588/TSL2591_DS000338_3-00-253098.pdf?src-supplier=Mouser; ComponentLink2URL: http://www1.futureelectronics.com/doc/AMS/TSL25911FN.pdf?src-supplier=Future+Electronics; ComponentLink2Description: http://www1.futureelectronics.com/doc/AMS/TSL25911FN.pdf?src-supplier=Future+Electronics; ComponentLink3URL: https://ams.com/documents/20143/36005/TSL2591_DS000338_6-00.pdf?src-supplier=Digi-Key; ComponentLink3Description: https://ams.com/documents/20143/36005/TSL2591_DS000338_6-00.pdf?src-supplier=Digi-Key; ComponentLink4URL: http://www.ams.com/eng/content/download/389383/1251117/221235?src-supplier=Digi-Key; ComponentLink4Description: http://www.ams.com/eng/content/download/389383/1251117/221235?src-supplier=Digi-Key; Supplier Part Number 1: TSL25911FNTR-ND
U7 = LIS2DH12TR: STMICROELECTRONICS - LIS2DH12TR - 3-AXIS ACCELEROMETER, DIGITAL, LGA-12; Min Supply Voltage: 1.71V; Max Supply Voltage: 3.6V; Bandwidth: 672Hz; Interface: I2C,SPI; Output Type: SPI,I2C,Digital; Axis: X, Y, Z; Supplier 1: Farnell; Manufacturer: STMicroelectronics; Manufacturer Part Number: LIS2DH12TR; Stock 1: 0; Mount: Surface Mount; Case/Package: LGA; Number of Pins: 12; Contact Plating: Gold; Min Operating Temperature: -40°C; Max Operating Temperature: 85°C; Packaging: Cut Tape; Length: 2.15mm; Height: 1mm; Width: 2.15mm; Radiation Hardening: No; REACH SVHC: No SVHC; Lead Free: Lead Free; ComponentLink1URL: http://www.farnell.com/datasheets/2006544.pdf?src-supplier=Element14; ComponentLink1Description: http://www.farnell.com/datasheets/2006544.pdf?src-supplier=Element14; Supplier Part Number 1: 2433081RL
U8 = BME280: Pressure, Temperature and Humidity Sensor Digital Output 1.8V 8-Pin LGA T/R; Manufacturer: Bosch; Supplier 1: Digi-Key; Manufacturer Part Number: BME280; Stock 1: 0; Case/Package: LGA; Number of Pins: 8; Lead Free: Lead Free; Supplier Part Number 1: 828-1063-2-ND
U9 = USBLC6-2SC6: TVS DIODE 5.25V 17V SOT23-6; Manufacturer: STMicroelectronics; Direction: Unidirectional,Bidirectional; Capacitance: 3.5pF; Operating Supply Voltage: 1.1V; Number of Channels: 2; Breakdown Voltage: 6V; Power Line Protection: Yes; Test Current: 1mA; Max Reverse Leakage Current: 150nA; Peak Pulse Current: 5A; Element Configuration: Dual; Data Rate: 480Mbps; Number of Elements: 1; Working Voltage: 5V; Supplier 1: Farnell; Manufacturer Part Number: USBLC6-2SC6; Stock 1: 0; Mount: Surface Mount; Case/Package: SOT-23; Number of Pins: 6; Contact Plating: Tin,Matte; Min Operating Temperature: -40°C; Max Operating Temperature: 125°C; Clamping Voltage: 17V; Packaging: Tape and Reel; Package Quantity: 3000; Termination: SMD/SMT; Number of Bidirectional Channels: 2; Reverse Standoff Voltage: 5.25V; Min Breakdown Voltage: 6V; ESD Protection: Yes; Leakage Current: 150nA; Reverse Breakdown Voltage: 6V; Polarity: Unidirectional,Bidirectional; Max Breakdown Voltage: 6V; Length: 3.05mm; Height: 1.3mm; Width: 1.75mm; Depth: 1.75mm; Radiation Hardening: No; REACH SVHC: No SVHC; Lead Free: Lead Free; ComponentLink1URL: http://www.farnell.com/datasheets/1690354.pdf?src-supplier=Element14; ComponentLink1Description: http://www.farnell.com/datasheets/1690354.pdf?src-supplier=Element14; ComponentLink2URL: http://www.st.com/content/ccc/resource/technical/document/datasheet/06/1d/48/9c/6c/20/4a/b2/CD00050750.pdf/files/CD00050750.pdf/jcr:content/translations/en.CD00050750.pdf?src-supplier=Mouser; ComponentLink2Description: http://www.st.com/content/ccc/resource/technical/document/datasheet/06/1d/48/9c/6c/20/4a/b2/CD00050750.pdf/files/CD00050750.pdf/jcr:content/translations/en.CD00050750.pdf?src-supplier=Mouser; ComponentLink3URL: http://www.st.com/web/en/resource/technical/document/datasheet/CD00050750.pdf?src-supplier=Future+Electronics; ComponentLink3Description: http://www.st.com/web/en/resource/technical/document/datasheet/CD00050750.pdf?src-supplier=Future+Electronics; ComponentLink4URL: http://www.st.com/content/ccc/resource/technical/document/datasheet/06/1d/48/9c/6c/20/4a/b2/CD00050750.pdf/files/CD00050750.pdf/jcr:content/translations/en.CD00050750.pdf?src-supplier=Verical; ComponentLink4Description: http://www.st.com/content/ccc/resource/technical/document/datasheet/06/1d/48/9c/6c/20/4a/b2/CD00050750.pdf/files/CD00050750.pdf/jcr:content/translations/en.CD00050750.pdf?src-supplier=Verical; ComponentLink5URL: http://datasheet.iiic.cc/stmicroelectronics/USBLC6-2SC6.pdf?src-supplier=IIIC; ComponentLink5Description: http://datasheet.iiic.cc/stmicroelectronics/USBLC6-2SC6.pdf?src-supplier=IIIC; ComponentLink6URL: http://www.produktinfo.conrad.com/datenblaetter/1100000-1199999/001184109-da-01-en-IC_ESD_PROTECTI_USBLC6_2SC6_SOT_23_6_STM.pdf?src-supplier=Conrad; ComponentLink6Description: http://www.produktinfo.conrad.com/datenblaetter/1100000-1199999/001184109-da-01-en-IC_ESD_PROTECTI_USBLC6_2SC6_SOT_23_6_STM.pdf?src-supplier=Conrad